# Altium schematic sheet Sheet4.SchDoc
size A3; Organization: Altium Limited; Address1: L3, 12a Rodborough Rd; Address2: Frenchs Forest; Address3: NSW; Address4: Australia 2086; SheetNumber: 4; SheetTotal: 6
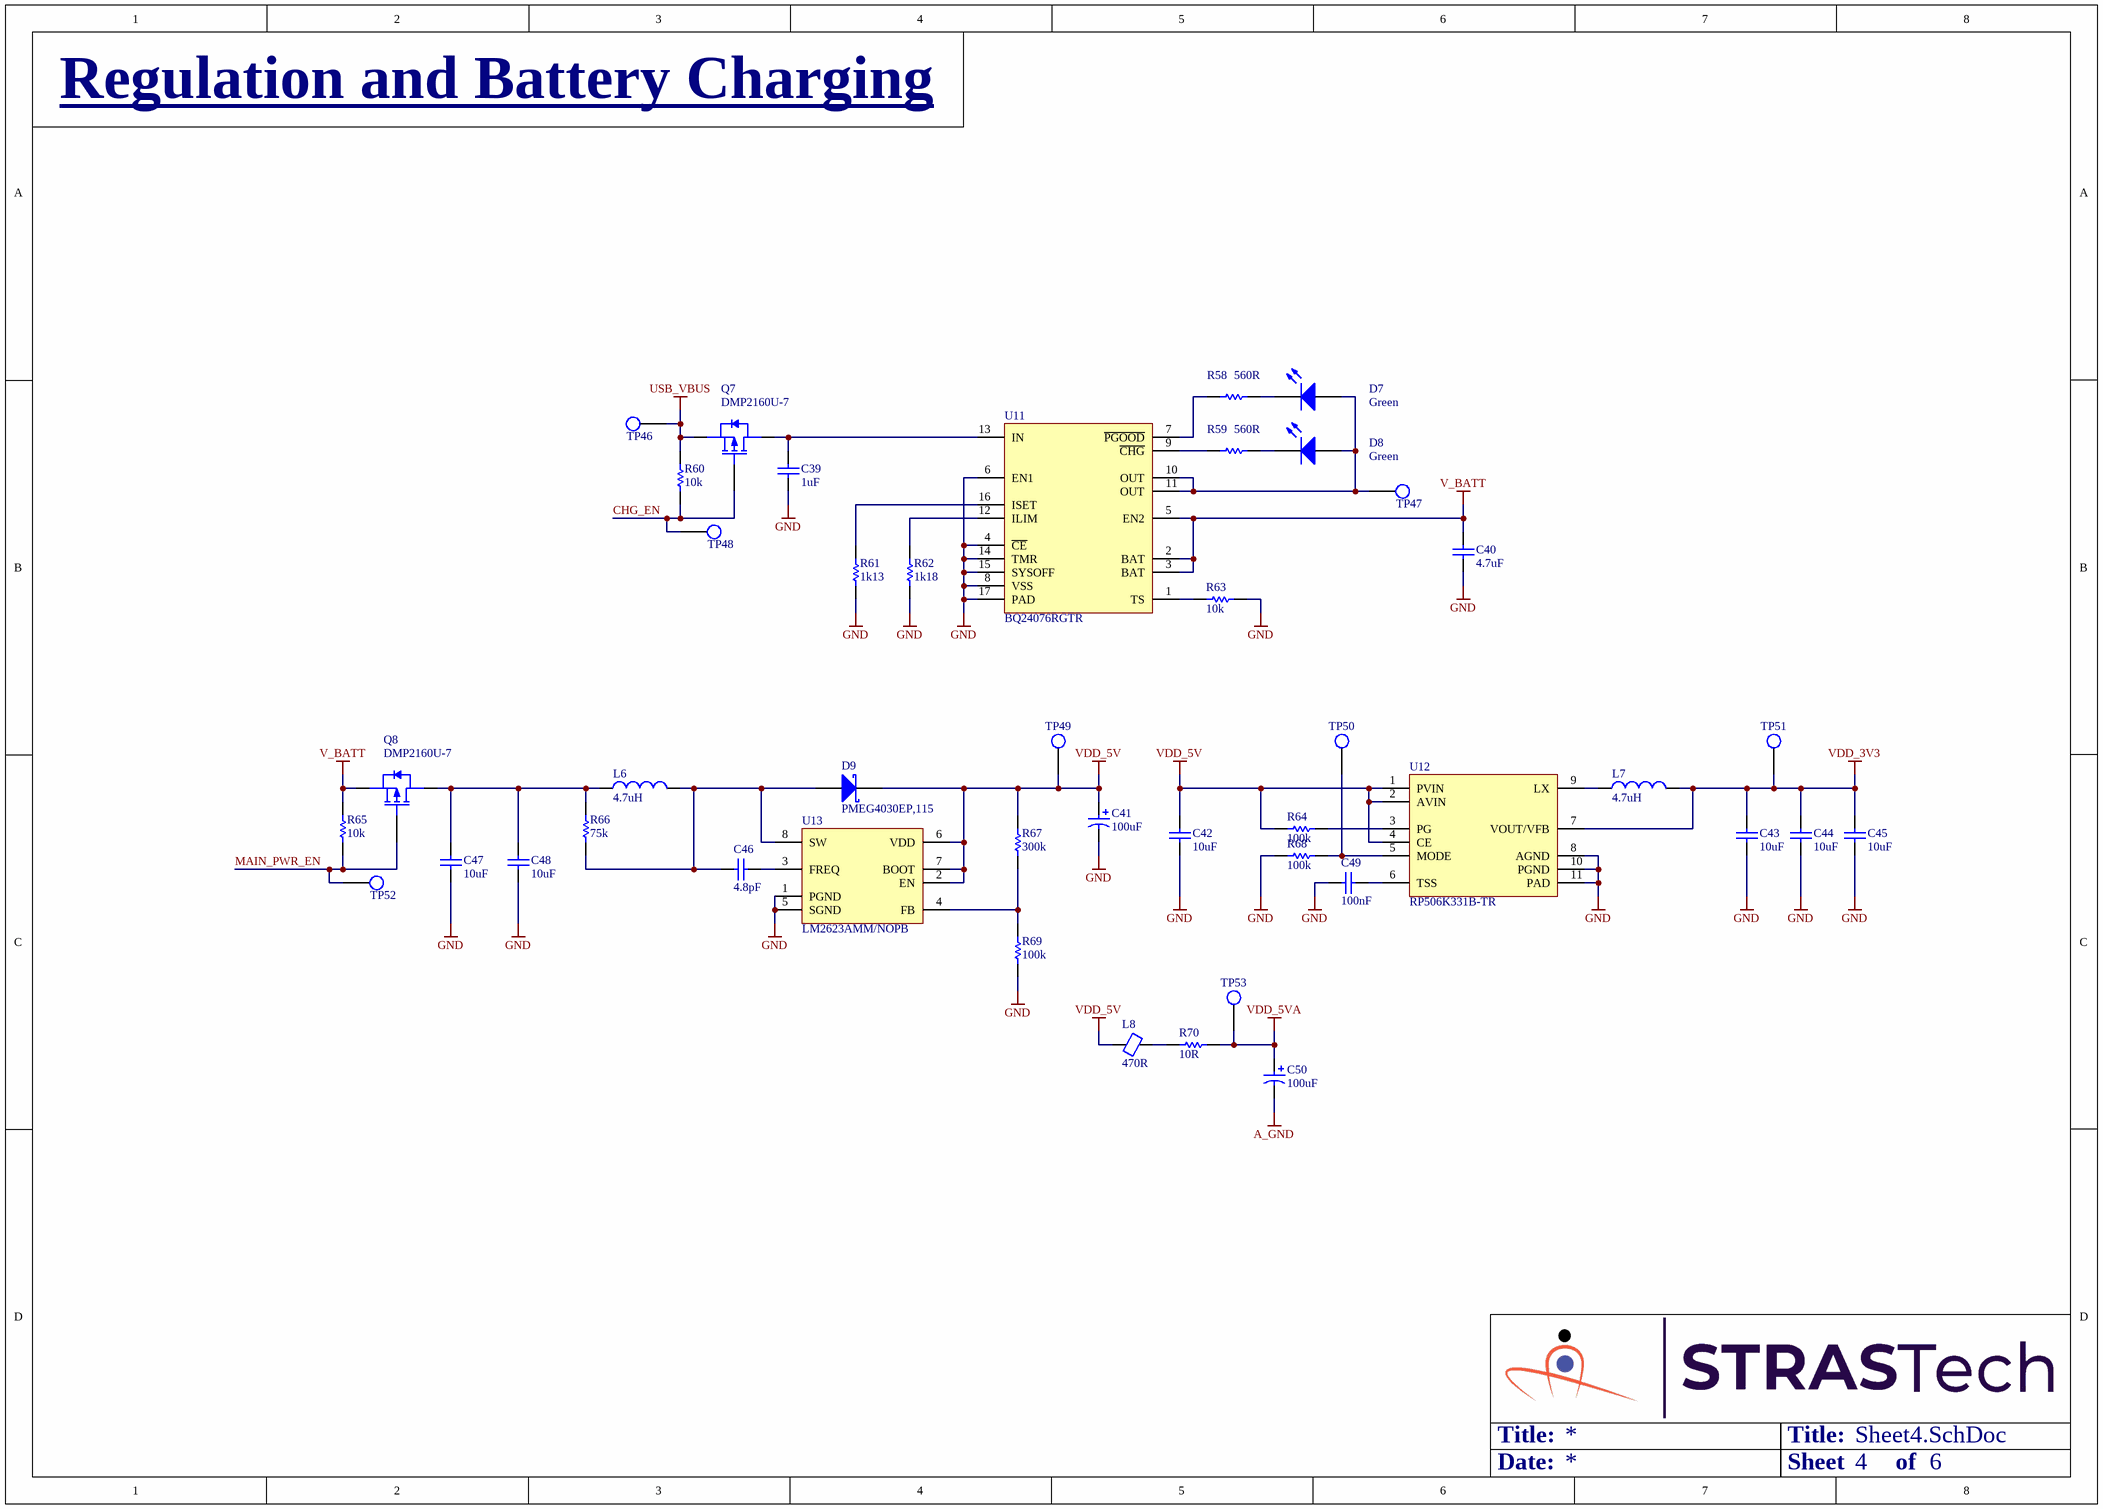
[diagram p0: Sheet4.SchDoc]

## Parts
C39  1uF  [Cap,SMD,0402]
C40  4.7uF  [Cap,SMD,0402]
C41  100uF  [Cap,Alum,SMD,D5,H5.8]
C42  10uF  [Cap,SMD,0402]
C43  10uF  [Cap,SMD,0402]
C44  10uF  [Cap,SMD,0402]
C45  10uF  [Cap,SMD,0402]
C46  4.8pF  [Cap,SMD,0402]
C47  10uF  [Cap,SMD,0402]
C48  10uF  [Cap,SMD,0402]
C49  100nF  [Cap,SMD,0402]
C50  100uF  [Cap,Alum,SMD,D5,H5.8]
D7  Green  [LED,0603]
D8  Green  [LED,0603]
D9  PMEG4030EP,115  [SOD128]
L6  4.7uH  [IND,WIREWOUND,4.9x4.9,SMD]
L7  4.7uH  [IND,WIREWOUND,4.9x4.9,SMD]
L8  470R  [IND,0402]
Q7  DMP2160U-7  [SOT23-3]
Q8  DMP2160U-7  [SOT23-3]
R58  560R  [RES,0402]
R59  560R  [RES,0402]
R60  10k  [RES,0402]
R61  1k13  [RES,0402]
R62  1k18  [RES,0402]
R63  10k  [RES,0402]
R64  100k  [RES,0402]
R65  10k  [RES,0402]
R66  75k  [RES,0402]
R67  300k  [RES,0402]
R68  100k  [RES,0402]
R69  100k  [RES,0402]
R70  10R  [RES,0402]
TP46  TESTPOINT  [testpoint,smd,round,1mm]  (value not drawn)
TP47  TESTPOINT  [testpoint,smd,round,1mm]  (value not drawn)
TP48  TESTPOINT  [testpoint,smd,round,1mm]  (value not drawn)
TP49  TESTPOINT  [testpoint,smd,round,1mm]  (value not drawn)
TP50  TESTPOINT  [testpoint,smd,round,1mm]  (value not drawn)
TP51  TESTPOINT  [testpoint,smd,round,1mm]  (value not drawn)
TP52  TESTPOINT  [testpoint,smd,round,1mm]  (value not drawn)
TP53  TESTPOINT  [testpoint,smd,round,1mm]  (value not drawn)
U11  BQ24076RGTR  [IC,QFN-16,3x3]
U12  RP506K331B-TR  [IC,DFN-10_3x3,P0.5mm]
U13  LM2623AMM/NOPB  [IC,TSSOP-8,W3.0]

## Nets
A_GND: C50.2
GND: C39.1 C40.1 C41.2 C42.1 C43.1 C44.1 C45.1 C47.1 C48.1 C49.1 R61.1 R62.1 R63.1 R68.2 R69.1 U11.4(~{CE}) U11.6(EN1) U11.8(VSS) U11.14(TMR) U11.15(SYSOFF) U11.17(PAD) U12.8(AGND) U12.10(PGND) U12.11(PAD) U13.1(PGND) U13.5(SGND)
USB_VBUS: Q7.2(S) R60.2 TP46.1(TP)
V_BATT: C40.2 Q8.2(S) R65.2 U11.2(BAT) U11.3(BAT) U11.5(EN2)
VDD_3V3: C43.2 C44.2 C45.2 L7.2 TP51.1(TP) U12.7(VOUT/VFB)
VDD_5V: C41.1 C42.2 D9.1(K) L8.1 R64.2 R67.2 TP49.1(TP) U12.1(PVIN) U12.2(AVIN) U12.4(CE) U13.2(EN) U13.6(VDD) U13.7(BOOT)
VDD_5VA: C50.1 R70.2 TP53.1(TP)
CHG_EN: Q7.1(G) R60.1 TP48.1(TP)
MAIN_PWR_EN: Q8.1(G) R65.1 TP52.1(TP)
NetC39_2: C39.2 Q7.3(D) U11.13(IN)
NetC46_1: C46.1 D9.2(A) L6.2 R66.1 U13.8(SW)
NetC46_2: C46.2 U13.3(FREQ)
NetC47_2: C47.2 C48.2 L6.1 Q8.3(D) R66.2
NetC49_2: C49.2 U12.6(TSS)
NetD7_1: D7.1(A) D8.1(A) TP47.1(TP) U11.10(OUT) U11.11(OUT)
NetD7_2: D7.2(K) R58.2
NetD8_2: D8.2(K) R59.2
NetL7_1: L7.1 U12.9(LX)
NetL8_2: L8.2 R70.1
NetR58_1: R58.1 U11.7(~{PGOOD})
NetR59_1: R59.1 U11.9(~{CHG})
NetR61_2: R61.2 U11.16(ISET)
NetR62_2: R62.2 U11.12(ILIM)
NetR63_2: R63.2 U11.1(TS)
NetR64_1: R64.1 U12.3(PG)
NetR67_1: R67.1 R69.2 U13.4(FB)
NetR68_1: R68.1 TP50.1(TP) U12.5(MODE)

## Notes on the sheet
- Regulation and Battery Charging
- Title:
- Date:
- Sheet
- of
- Title
- Size:
- A3
- Revision:
- Design By:

## Library data of the parts
C39 = CAP,Cer,1uF,35VDC,X5R,0402: 1 µF ±10% 35V Ceramic Capacitor X5R 0402 (1005 Metric); Vendor Part Number: 445-9073-1-ND; Manufacturer: TDK Corporation; Manufacturer Part Number: C1005X5R1V105K050BC; Vendor: Digikey; HelpURL: https://product.tdk.com/info/en/catalog/datasheets/mlcc_commercial_general_en.pdf?ref_disty=digikey; CreatedBy: Judd Foster
C40 = CAP,Cer,4.7uF,16VDC,X5R,0402: 4.7 µF ±20% 16V Ceramic Capacitor X5R 0402 (1005 Metric); Vendor Part Number: 478-10788-1-ND; Manufacturer: AVX Corporation; Manufacturer Part Number: 0402YD475MAT2A; Vendor: Digikey; HelpURL: https://datasheets.avx.com/cx5r.pdf; CreatedBy: Judd Foster
C41 C50 = CAP,Alum,100uF,10VDC,SMD: CAP ALUM 100UF 20% 10V SMD; Vendor Part Number: PCE3867CT-ND; Manufacturer: Panasonic; Manufacturer Part Number: EEE-1AA101WR; Vendor: Digikey; HelpURL: https://media.digikey.com/pdf/Data%20Sheets/Panasonic%20Electronic%20Components/S_Series,Type_V_Rev2018.pdf; CreatedBy: Judd Foster
C42-C45 C47 C48 = CAP,Cer,10uF,10VDC,X5R,0402: 10 µF ±20% 10V Ceramic Capacitor X5R 0402 (1005 Metric); Vendor Part Number: 1276-1450-1-ND; Manufacturer: Samsung Electro-Mechanics; Manufacturer Part Number: CL05A106MP5NUNC; Vendor: Digikey; HelpURL: https://media.digikey.com/pdf/Data%20Sheets/Samsung%20PDFs/CL05A106MP5NUNC_Spec.pdf; CreatedBy: Judd Foster
C46 = CAP,Cer,4.8pF,50VDC,C0G/NP0,0402: 4.8 pF ±0.25pF 50V Ceramic Capacitor C0G, NP0 0402 (1005 Metric); Vendor Part Number: 490-17481-1-ND; Manufacturer: Murata Electronics; Manufacturer Part Number: GCQ1555C1H4R8CB01D; Vendor: Digikey; HelpURL: https://search.murata.co.jp/Ceramy/image/img/A01X/G101/ENG/GCQ1555C1H4R8CB01-01.pdf; CreatedBy: Judd Foster
C49 = CAP,Cer,100nF,25VDC,X7R,0402: 0.1µF ±10% 25V Ceramic Capacitor X7R 0402 (1005 Metric); Vendor Part Number: 490-14603-1-ND; Manufacturer: Murata Electronics; Manufacturer Part Number: GRM155R71E104KE14J; Vendor: Digikey; HelpURL: https://search.murata.co.jp/Ceramy/image/img/A01X/G101/ENG/GRM155R71E104KE14-01.pdf; CreatedBy: Judd Foster
D7 D8 = LED,Green,SMD,0603: Green 530nm LED Indication - Discrete 3V 0603 (1608 Metric); Manufacturer: Stanley Electric Co; Manufacturer Part Number: THG1111C-0005-TR; Vendor Part Number: 404-1286-1-ND; Vendor: Digikey; CreatedBy: Judd Foster; HelpURL: http://www.stanley-components.com/php/downloaddatafile.php?rp=0,THG1111C-0005_e.pdf
D9 = DIODE,Schottky,40V,3A,SMD: Diode Schottky 40V 3A Surface Mount CFP5; Manufacturer: Nexperia USA Inc.; Vendor Part Number: 1727-5841-1-ND; Vendor: Digikey; CreatedBy: Judd Foster; HelpURL: https://assets.nexperia.com/documents/data-sheet/PMEG4030EP.pdf; Manufacturer Part Number: PMEG4030EP,115
L6 L7 = IND,4.7uH,2.6A,Wirewound,SMD: 4.7µH Shielded Wirewound Inductor 2.6A 45.5mOhm Max Nonstandard; Vendor Part Number: 587-3605-1-ND; Manufacturer: Taiyo Yuden; Manufacturer Part Number: NRS5030T4R7MMGJV; Vendor: Digikey; HelpURL: https://ds.yuden.co.jp/TYCOMPAS/ut/detail?pn=NRS5030T4R7MMGJV%20%20&u=M; CreatedBy: Judd Foster
L8 = Ferrite,470R@100MHz,0402: 470 Ohms @ 100 MHz 1 Power Line Ferrite Bead 0402 (1005 Metric) 1A 200mOhm; Vendor Part Number: 490-10662-1-ND; Manufacturer: Murata Electronics; Manufacturer Part Number: BLM15PX471SN1D; Vendor: Digikey; HelpURL: https://www.murata.com/en-us/products/productdata/8796740059166/ENFA0018.pdf; CreatedBy: Judd Foster
Q7 Q8 = MOSFET,P Ch,20V,3.2A: P-Channel 20 V 3.2A (Ta) 1.4W (Ta) Surface Mount SOT-23-3; Manufacturer: Diodes Incorporated; Vendor Part Number: DMP2160UDICT-ND; Vendor: Digikey; CreatedBy: Judd Foster; HelpURL: https://media.digikey.com/pdf/Data%20Sheets/Diodes%20PDFs/DMP2160U.pdf; Manufacturer Part Number: DMP2160U-7
R58 R59 = RES,560R,1%,0.063W,0402: 560 Ohms ±1% 0.063W, 1/16W Chip Resistor 0402 (1005 Metric) Automotive AEC-Q200, Moisture Resistant Thick Film; Manufacturer: TE Connectivity Passive Product; Manufacturer Part Number: CRGCQ0402F560R; Vendor Part Number: A129624CT-ND; Vendor: Digikey; CreatedBy: Judd Foster; HelpURL: https://www.te.com/commerce/DocumentDelivery/DDEController?Action=srchrtrv&DocNm=1773204-3&DocType=DS&DocLang=English
R60 R63 R65 = RES,10k,5%,0.063W,0402: 10 kOhms ±5% 0.063W, 1/16W Chip Resistor 0402 (1005 Metric) Automotive AEC-Q200 Thick Film; Vendor Part Number: RMCF0402JT10K0CT-ND; Manufacturer: Stackpole Electronics Inc; Manufacturer Part Number: RMCF0402JT10K0; Vendor: DIgikey; HelpURL: https://www.seielect.com/catalog/sei-rmcf_rmcp.pdf; CreatedBy: Judd Foster
R61 = RES,1k13,1%,0.063W,0402: 1.13 kOhms ±1% 0.063W, 1/16W Chip Resistor 0402 (1005 Metric) Automotive AEC-Q200 Thick Film; Manufacturer: Stackpole Electronics Inc; Manufacturer Part Number: RMCF0402FT1K13; Vendor Part Number: RMCF0402FT1K13CT-ND; Vendor: Digikey; CreatedBy: Judd Foster; HelpURL: https://www.seielect.com/catalog/sei-rmcf_rmcp.pdf
R62 = RES,1k18,1%,0.063W,0402: 1.18 kOhms ±1% 0.063W, 1/16W Chip Resistor 0402 (1005 Metric) Automotive AEC-Q200 Thick Film; Manufacturer: Stackpole Electronics Inc; Manufacturer Part Number: RMCF0402FT1K18; Vendor Part Number: RMCF0402FT1K18CT-ND; Vendor: Digikey; CreatedBy: Judd Foster; HelpURL: https://www.seielect.com/catalog/sei-rmcf_rmcp.pdf
R64 R68 R69 = RES,100k,5%,0.1W,0402: 100 kOhms ±5% 0.1W, 1/10W Chip Resistor 0402 (1005 Metric) Automotive AEC-Q200 Thick Film; Manufacturer: Panasonic Electronic Components; Manufacturer Part Number: ERJ-2GEJ104X; Vendor Part Number: P100KJCT-ND; Vendor: Digikey; CreatedBy: Judd Foster; HelpURL: https://b2b-api.panasonic.eu/file_stream/pids/fileversion/1242
R66 = RES,75k,0.1%,0.063W,0402: 75 kOhms ±0.1% 0.063W, 1/16W Chip Resistor 0402 (1005 Metric) - Thin Film; Vendor Part Number: YAG4414CT-ND; Manufacturer: YAGEO; Manufacturer Part Number: RT0402BRE0775KL; Vendor: DIgikey; HelpURL: https://www.yageo.com/upload/media/product/productsearch/datasheet/rchip/PYu-RT_1-to-0.01_RoHS_L_12.pdf; CreatedBy: Judd Foster
R67 = RES,300k,1%,0.063W,0402: 300 kOhms ±1% 0.063W, 1/16W Chip Resistor 0402 (1005 Metric) Automotive AEC-Q200 Thick Film; Manufacturer: Stackpole Electronics Inc; Manufacturer Part Number: RMCF0402FT300K; Vendor Part Number: RMCF0402FT300KCT-ND; Vendor: Digikey; CreatedBy: Judd Foster; HelpURL: https://www.seielect.com/catalog/sei-rmcf_rmcp.pdf
R70 = RES,10R,1%,0.063W,0402: 10 Ohms ±1% 0.063W, 1/16W Chip Resistor 0402 (1005 Metric) Automotive AEC-Q200 Thick Film; Manufacturer: Panasonic Electronic Components; Manufacturer Part Number: ERJ-2RKF10R0X; Vendor Part Number: P10.0LCT-ND; Vendor: Digikey; CreatedBy: Judd Foster; HelpURL: https://industrial.panasonic.com/cdbs/www-data/pdf/RDA0000/AOA0000C304.pdf
TP46-TP53 = TESTPOINT: PCB Testpoint; CreatedBy: Judd Foster; HelpURL: N/A; Manufacturer: N/A; Manufacturer Part Number: N/A; Vendor: N/A; Vendor Part Number: N/A
U11 = BQ24076RGTR: Charger IC Lithium Ion 16-VQFN (3x3); Vendor Part Number: 296-52627-1-ND; Manufacturer: Texas Instruments; Vendor: Digikey; HelpURL: https://www.ti.com/general/docs/suppproductinfo.tsp?distId=10&gotoUrl=https%3A%2F%2Fwww.ti.com%2Flit%2Fgpn%2Fbq24076; Manufacturer Part Number: BQ24076RGTR; CreatedBy: Judd Foster
U12 = RP506K331B-TR: Buck Switching Regulator IC Positive Fixed 3.3V 1 Output 2A 10-UFDFN Exposed Pad; Manufacturer: Nisshinbo Micro Devices Inc.; Vendor Part Number: 2129-RP506K331B-CT-ND; Vendor: Digikey; CreatedBy: Judd Foster; HelpURL: https://www.nisshinbo-microdevices.co.jp/en/pdf/datasheet/rp506-ea.pdf; Manufacturer Part Number: RP506K331B-TR
U13 = LM2623AMM/NOPB: Boost Switching Regulator IC Positive Adjustable 1.24V 1 Output 2.2A (Switch) 8-TSSOP, 8-MSOP (0.118", 3.00mm Width); Vendor Part Number: LM2623AMM/NOPBCT-ND; Manufacturer: Texas Instruments; Vendor: Digikey; Manufacturer Part Number: LM2623AMM/NOPB; HelpURL: https://www.ti.com/general/docs/suppproductinfo.tsp?distId=10&gotoUrl=https%3A%2F%2Fwww.ti.com%2Flit%2Fgpn%2Flm2623; CreatedBy: Judd Foster